# Altium schematic sheet Kernel.SchDoc
size A3
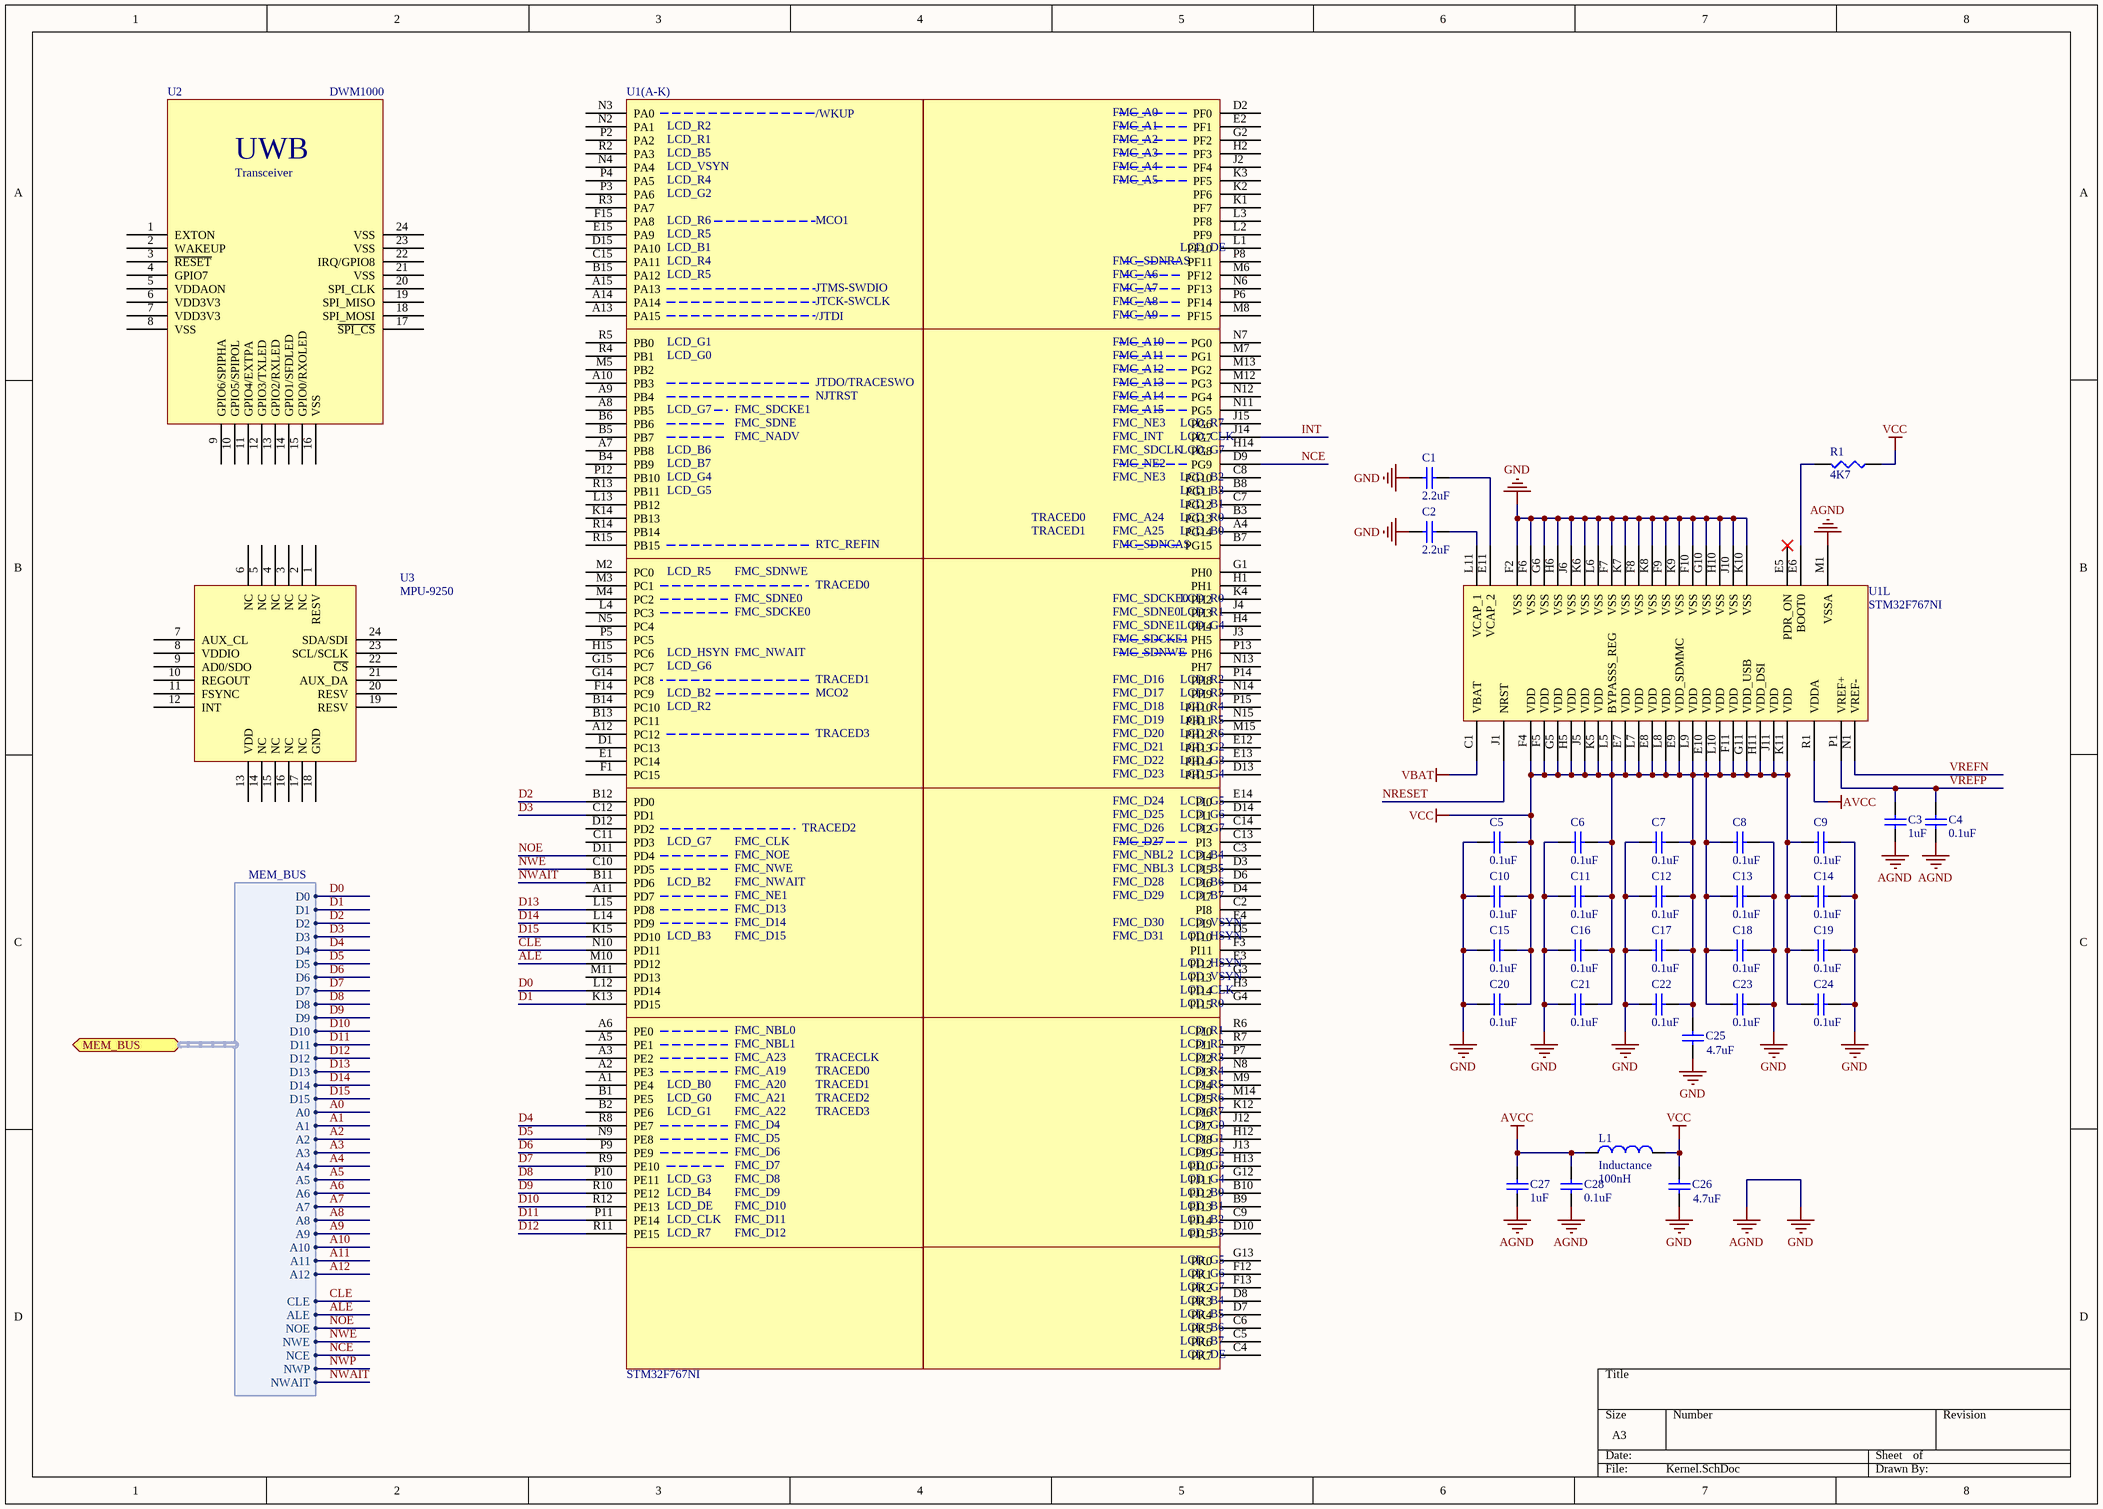
[diagram p0: Kernel.SchDoc]

## Parts
C1  value 2.2uF  [CAP0402]  (hidden comment: ChipCap)
C2  value 2.2uF  [CAP0402]  (hidden comment: ChipCap)
C3  value 1uF  [CAP0805]  (hidden comment: ChipCap)
C4  value 0.1uF  [CAP0603]  (hidden comment: ChipCap)
C5  value 0.1uF  [CAP0201]  (hidden comment: ChipCap)
C6  value 0.1uF  [CAP0201]  (hidden comment: ChipCap)
C7  value 0.1uF  [CAP0201]  (hidden comment: ChipCap)
C8  value 0.1uF  [CAP0201]  (hidden comment: ChipCap)
C9  value 0.1uF  [CAP0201]  (hidden comment: ChipCap)
C10  value 0.1uF  [CAP0201]  (hidden comment: ChipCap)
C11  value 0.1uF  [CAP0201]  (hidden comment: ChipCap)
C12  value 0.1uF  [CAP0201]  (hidden comment: ChipCap)
C13  value 0.1uF  [CAP0201]  (hidden comment: ChipCap)
C14  value 0.1uF  [CAP0201]  (hidden comment: ChipCap)
C15  value 0.1uF  [CAP0201]  (hidden comment: ChipCap)
C16  value 0.1uF  [CAP0201]  (hidden comment: ChipCap)
C17  value 0.1uF  [CAP0201]  (hidden comment: ChipCap)
C18  value 0.1uF  [CAP0201]  (hidden comment: ChipCap)
C19  value 0.1uF  [CAP0201]  (hidden comment: ChipCap)
C20  value 0.1uF  [CAP0201]  (hidden comment: ChipCap)
C21  value 0.1uF  [CAP0201]  (hidden comment: ChipCap)
C22  value 0.1uF  [CAP0201]  (hidden comment: ChipCap)
C23  value 0.1uF  [CAP0201]  (hidden comment: ChipCap)
C24  value 0.1uF  [CAP0201]  (hidden comment: ChipCap)
C25  value 4.7uF  [CAPC3216]  (hidden comment: Cap chip)
C26  value 4.7uF  [CAPC3216]  (hidden comment: Cap chip)
C27  value 1uF  [CAP0805]  (hidden comment: ChipCap)
C28  value 0.1uF  [CAP0603]  (hidden comment: ChipCap)
L1  Inductance  value 100nH  [CM20]
R1  value 4K7  [RES0603]  (hidden comment: ChipRes)
U1  STM32F767NI  [TFBGA216]  (value not drawn)  (parts A,B,C,D,E,F,G,H,I,J,K,L of 12)
U2  DWM1000  [DWM1000]
U3  MPU-9250  [QFN24]

## Ports
MEM_BUS (harness MEM_BUS)

## Harnesses
MEM_BUS: D0, D1, D2, D3, D4, D5, D6, D7, D8, D9, D10, D11, D12, D13, D14, D15, CLE, ALE, NOE, NWE, NCE, NWP, NWAIT, A0, A1, A2, A3, A4, A5, A6, A7, A8, A9, A10, A11, A12

## Nets
AGND: C1.2 C2.2 C3.2 C4.2 C5.2 C6.2 C7.2 C8.1 C9.1 C10.2 C11.2 C12.2 C13.1 C14.1 C15.2 C16.2 C17.2 C18.1 C19.1 C20.2 C21.2 C22.2 C23.1 C24.1 C25.1 C26.1 C27.2 C28.2 U1.F2(VSS) U1.F6(VSS) U1.F7(VSS) U1.F8(VSS) U1.F9(VSS) U1.F10(VSS) U1.G6(VSS) U1.G10(VSS) U1.H6(VSS) U1.H10(VSS) U1.J6(VSS) U1.J10(VSS) U1.K6(VSS) U1.K7(VSS) U1.K8(VSS) U1.K9(VSS) U1.K10(VSS) U1.L6(VSS) U1.M1(VSSA)  [also labelled GND]
AVCC: C27.1 C28.1 L1.2 U1.R1(VDDA)
VBAT: U1.C1(VBAT)
VCC: C5.1 C6.1 C7.1 C8.2 C9.2 C10.1 C11.1 C12.1 C13.2 C14.2 C15.1 C16.1 C17.1 C18.2 C19.2 C20.1 C21.1 C22.1 C23.2 C24.2 C25.2 C26.2 L1.1 R1.1 U1.E7(VDD) U1.E8(VDD) U1.E9(VDD_SDMMC) U1.E10(VDD) U1.F4(VDD) U1.F5(VDD) U1.F11(VDD) U1.G5(VDD) U1.G11(VDD_USB) U1.H5(VDD) U1.H11(VDD_DSI) U1.J5(VDD) U1.J11(VDD) U1.K5(VDD) U1.K11(VDD) U1.L5(BYPASSS_REG) U1.L7(VDD) U1.L8(VDD) U1.L9(VDD) U1.L10(VDD)
A0: port MEM_BUS.A0
A1: port MEM_BUS.A1
A2: port MEM_BUS.A2
A3: port MEM_BUS.A3
A4: port MEM_BUS.A4
A5: port MEM_BUS.A5
A6: port MEM_BUS.A6
A7: port MEM_BUS.A7
A8: port MEM_BUS.A8
A9: port MEM_BUS.A9
A10: port MEM_BUS.A10
A11: port MEM_BUS.A11
A12: port MEM_BUS.A12
ALE: U1.M10(PD12) ; port MEM_BUS.ALE
CLE: U1.N10(PD11) ; port MEM_BUS.CLE
D0: U1.L12(PD14) ; port MEM_BUS.D0
D1: U1.K13(PD15) ; port MEM_BUS.D1
D2: U1.B12(PD0) ; port MEM_BUS.D2
D3: U1.C12(PD1) ; port MEM_BUS.D3
D4: U1.R8(PE7) ; port MEM_BUS.D4
D5: U1.N9(PE8) ; port MEM_BUS.D5
D6: U1.P9(PE9) ; port MEM_BUS.D6
D7: U1.R9(PE10) ; port MEM_BUS.D7
D8: U1.P10(PE11) ; port MEM_BUS.D8
D9: U1.R10(PE12) ; port MEM_BUS.D9
D10: U1.R12(PE13) ; port MEM_BUS.D10
D11: U1.P11(PE14) ; port MEM_BUS.D11
D12: U1.R11(PE15) ; port MEM_BUS.D12
D13: U1.L15(PD8) ; port MEM_BUS.D13
D14: U1.L14(PD9) ; port MEM_BUS.D14
D15: U1.K15(PD10) ; port MEM_BUS.D15
INT: U1.J14(PG7)
NCE: U1.D9(PG9) ; port MEM_BUS.NCE
NOE: U1.D11(PD4) ; port MEM_BUS.NOE
NRESET: U1.J1(NRST)
NWAIT: U1.B11(PD6) ; port MEM_BUS.NWAIT
NWE: U1.C10(PD5) ; port MEM_BUS.NWE
NWP: port MEM_BUS.NWP
VREFN: U1.N1(VREF-)
VREFP: C3.1 C4.1 U1.P1(VREF+)
NetC1_1: C1.1 U1.E11(VCAP_2)
NetC2_1: C2.1 U1.L11(VCAP_1)
NetR1_2: R1.2 U1.E6(BOOT0)

Not connected (* = marked no-connect by the designer): U1 A1(PE4) A2(PE3) A3(PE2) A4(PG14) A5(PE1) A6(PE0) A7(PB8) A8(PB5) A9(PB4) A10(PB3) A11(PD7) A12(PC12) A13(PA15) A14(PA14) A15(PA13) B1(PE5) B2(PE6) B3(PG13) B4(PB9) B5(PB7) B6(PB6) B7(PG15) B8(PG11) B9(PJ13) B10(PJ12) B13(PC11) B14(PC10) B15(PA12) C2(PI8) C3(PI4) C4(PK7) C5(PK6) C6(PK5) C7(PG12) C8(PG10) C9(PJ14) C11(PD3) C13(PI3) C14(PI2) C15(PA11) D1(PC13) D2(PF0) D3(PI5) D4(PI7) D5(PI10) D6(PI6) D7(PK4) D8(PK3) D10(PJ15) D12(PD2) D13(PH15) D14(PI1) D15(PA10) E1(PC14) E2(PF1) E3(PI12) E4(PI9) E5(PDR_ON)* E12(PH13) E13(PH14) E14(PI0) E15(PA9) F1(PC15) F3(PI11) F12(PK1) F13(PK2) F14(PC9) F15(PA8) G1(PH0) G2(PF2) G3(PI13) G4(PI15) G12(PJ11) G13(PK0) G14(PC8) G15(PC7) H1(PH1) H2(PF3) H3(PI14) H4(PH4) H12(PJ8) H13(PJ10) H14(PG8) H15(PC6) J2(PF4) J3(PH5) J4(PH3) J12(PJ7) J13(PJ9) J15(PG6) K1(PF7) K2(PF6) K3(PF5) K4(PH2) K12(PJ6) K14(PB13) L1(PF10) L2(PF9) L3(PF8) L4(PC3) L13(PB12) M2(PC0) M3(PC1) M4(PC2) M5(PB2) M6(PF12) M7(PG1) M8(PF15) M9(PJ4) M11(PD13) M12(PG3) M13(PG2) M14(PJ5) M15(PH12) N2(PA1) N3(PA0) N4(PA4) N5(PC4) N6(PF13) N7(PG0) N8(PJ3) N11(PG5) N12(PG4) N13(PH7) N14(PH9) N15(PH11) P2(PA2) P3(PA6) P4(PA5) P5(PC5) P6(PF14) P7(PJ2) P8(PF11) P12(PB10) P13(PH6) P14(PH8) P15(PH10) R2(PA3) R3(PA7) R4(PB1) R5(PB0) R6(PJ0) R7(PJ1) R13(PB11) R14(PB14) R15(PB15); U2 1(EXTON) 2(WAKEUP) 3(~{RESET}) 4(GPIO7) 5(VDDAON) 6(VDD3V3) 7(VDD3V3) 8(VSS) 9(GPIO6/SPIPHA) 10(GPIO5/SPIPOL) 11(GPIO4/EXTPA) 12(GPIO3/TXLED) 13(GPIO2/RXLED) 14(GPIO1/SFDLED) 15(GPIO0/RXOLED) 16(VSS) 17(~{SPI_CS}) 18(SPI_MOSI) 19(SPI_MISO) 20(SPI_CLK) 21(VSS) 22(IRQ/GPIO8) 23(VSS) 24(VSS); U3 1(RESV) 2(NC) 3(NC) 4(NC) 5(NC) 6(NC) 7(AUX_CL) 8(VDDIO) 9(AD0/SDO) 10(REGOUT) 11(FSYNC) 12(INT) 13(VDD) 14(NC) 15(NC) 16(NC) 17(NC) 18(GND) 19(RESV) 20(RESV) 21(AUX_DA) 22(~{CS}) 23(SCL/SCLK) 24(SDA/SDI)

## Notes on the sheet
- (near U1) U1(A-K)
- STM32F767NI
- (in symbol DWM1000) UWB; Transceiver
- (in symbol STM32F767NI, part A) /WKUP; LCD_R2; LCD_R1; LCD_B5; LCD_VSYN; LCD_R4; LCD_G2; LCD_R6; MCO1; LCD_R5; LCD_B1; JTMS-SWDIO; JTCK-SWCLK; /JTDI
- (in symbol STM32F767NI, part B) LCD_G1; LCD_G0; JTDO/TRACESWO; NJTRST; LCD_G7; FMC_SDCKE1; FMC_SDNE; FMC_NADV; LCD_B6; LCD_B7; LCD_G4; LCD_G5; RTC_REFIN
- (in symbol STM32F767NI, part C) LCD_R5; FMC_SDNWE; TRACED0; FMC_SDNE0; FMC_SDCKE0; LCD_HSYN; FMC_NWAIT; LCD_G6; TRACED1; LCD_B2; MCO2; LCD_R2; TRACED3
- (in symbol STM32F767NI, part D) TRACED2; LCD_G7; FMC_CLK; FMC_NOE; FMC_NWE; LCD_B2; FMC_NWAIT; FMC_NE1; FMC_D13; FMC_D14; LCD_B3; FMC_D15
- (in symbol STM32F767NI, part E) FMC_NBL0; FMC_NBL1; FMC_A23; TRACECLK; FMC_A19; TRACED0; LCD_B0; FMC_A20; TRACED1; LCD_G0; FMC_A21; TRACED2; LCD_G1; FMC_A22; TRACED3; FMC_D4; FMC_D5; FMC_D6; FMC_D7; LCD_G3; FMC_D8; LCD_B4; FMC_D9; LCD_DE; FMC_D10; LCD_CLK; FMC_D11; LCD_R7; FMC_D12
- (in symbol STM32F767NI, part F) FMC_A0; FMC_A1; FMC_A2; FMC_A3; FMC_A4; FMC_A5; LCD_DE; FMC_SDNRAS; FMC_A6; FMC_A7; FMC_A8; FMC_A9
- (in symbol STM32F767NI, part G) FMC_A10; FMC_A11; FMC_A12; FMC_A13; FMC_A14; FMC_A15; FMC_NE3; LCD_R7; FMC_INT; LCD_CLK; FMC_SDCLK; LCD_G7; FMC_NE2; LCD_B2; LCD_B3; LCD_B1; TRACED0; FMC_A24; LCD_R0; TRACED1; FMC_A25; LCD_B0; FMC_SDNCAS
- (in symbol STM32F767NI, part H) FMC_SDCKE0; LCD_R0; FMC_SDNE0; LCD_R1; FMC_SDNE1; LCD_G4; FMC_SDCKE1; FMC_SDNWE; FMC_D16; LCD_R2; FMC_D17; LCD_R3; FMC_D18; LCD_R4; FMC_D19; LCD_R5; FMC_D20; LCD_R6; FMC_D21; LCD_G2; FMC_D22; LCD_G3; FMC_D23
- (in symbol STM32F767NI, part I) FMC_D24; LCD_G5; FMC_D25; LCD_G6; FMC_D26; LCD_G7; FMC_D27; FMC_NBL2; LCD_B4; FMC_NBL3; LCD_B5; FMC_D28; LCD_B6; FMC_D29; LCD_B7; FMC_D30; LCD_VSYN; FMC_D31; LCD_HSYN; LCD_CLK; LCD_R0
- (in symbol STM32F767NI, part J) LCD_R1; LCD_R2; LCD_R3; LCD_R4; LCD_R5; LCD_R6; LCD_R7; LCD_G0; LCD_G1; LCD_G2; LCD_G3; LCD_G4; LCD_B0; LCD_B1; LCD_B2; LCD_B3
- (in symbol STM32F767NI, part K) LCD_G5; LCD_G6; LCD_G7; LCD_B4; LCD_B5; LCD_B6; LCD_B7; LCD_DE

## Library data of the parts
C1-C24 C27 C28 = ChipCap: Capacitor; Published: 8-Jun-2000; LatestRevisionDate: 17-Jul-2002; LatestRevisionNote: Re-released for DXP Platform.; PackageReference: RAD-0.3; Publisher: Altium Limited
C25 C26 = Cap chip: Chip Capacitor; Published: 8-Jun-2000; LatestRevisionDate: 17-Jul-2002; LatestRevisionNote: Re-released for DXP Platform.; PackageReference: RAD-0.3; Publisher: Altium Limited; Supplier 1: Digi-Key; Supplier Part Number 1: 399-1249-1-ND
L1 = ChipInductance
R1 = ChipRes: Chip resistor
U2 = DWM1000: UWB transceiver
U3 = MPU-9250: 9-Axis sensor